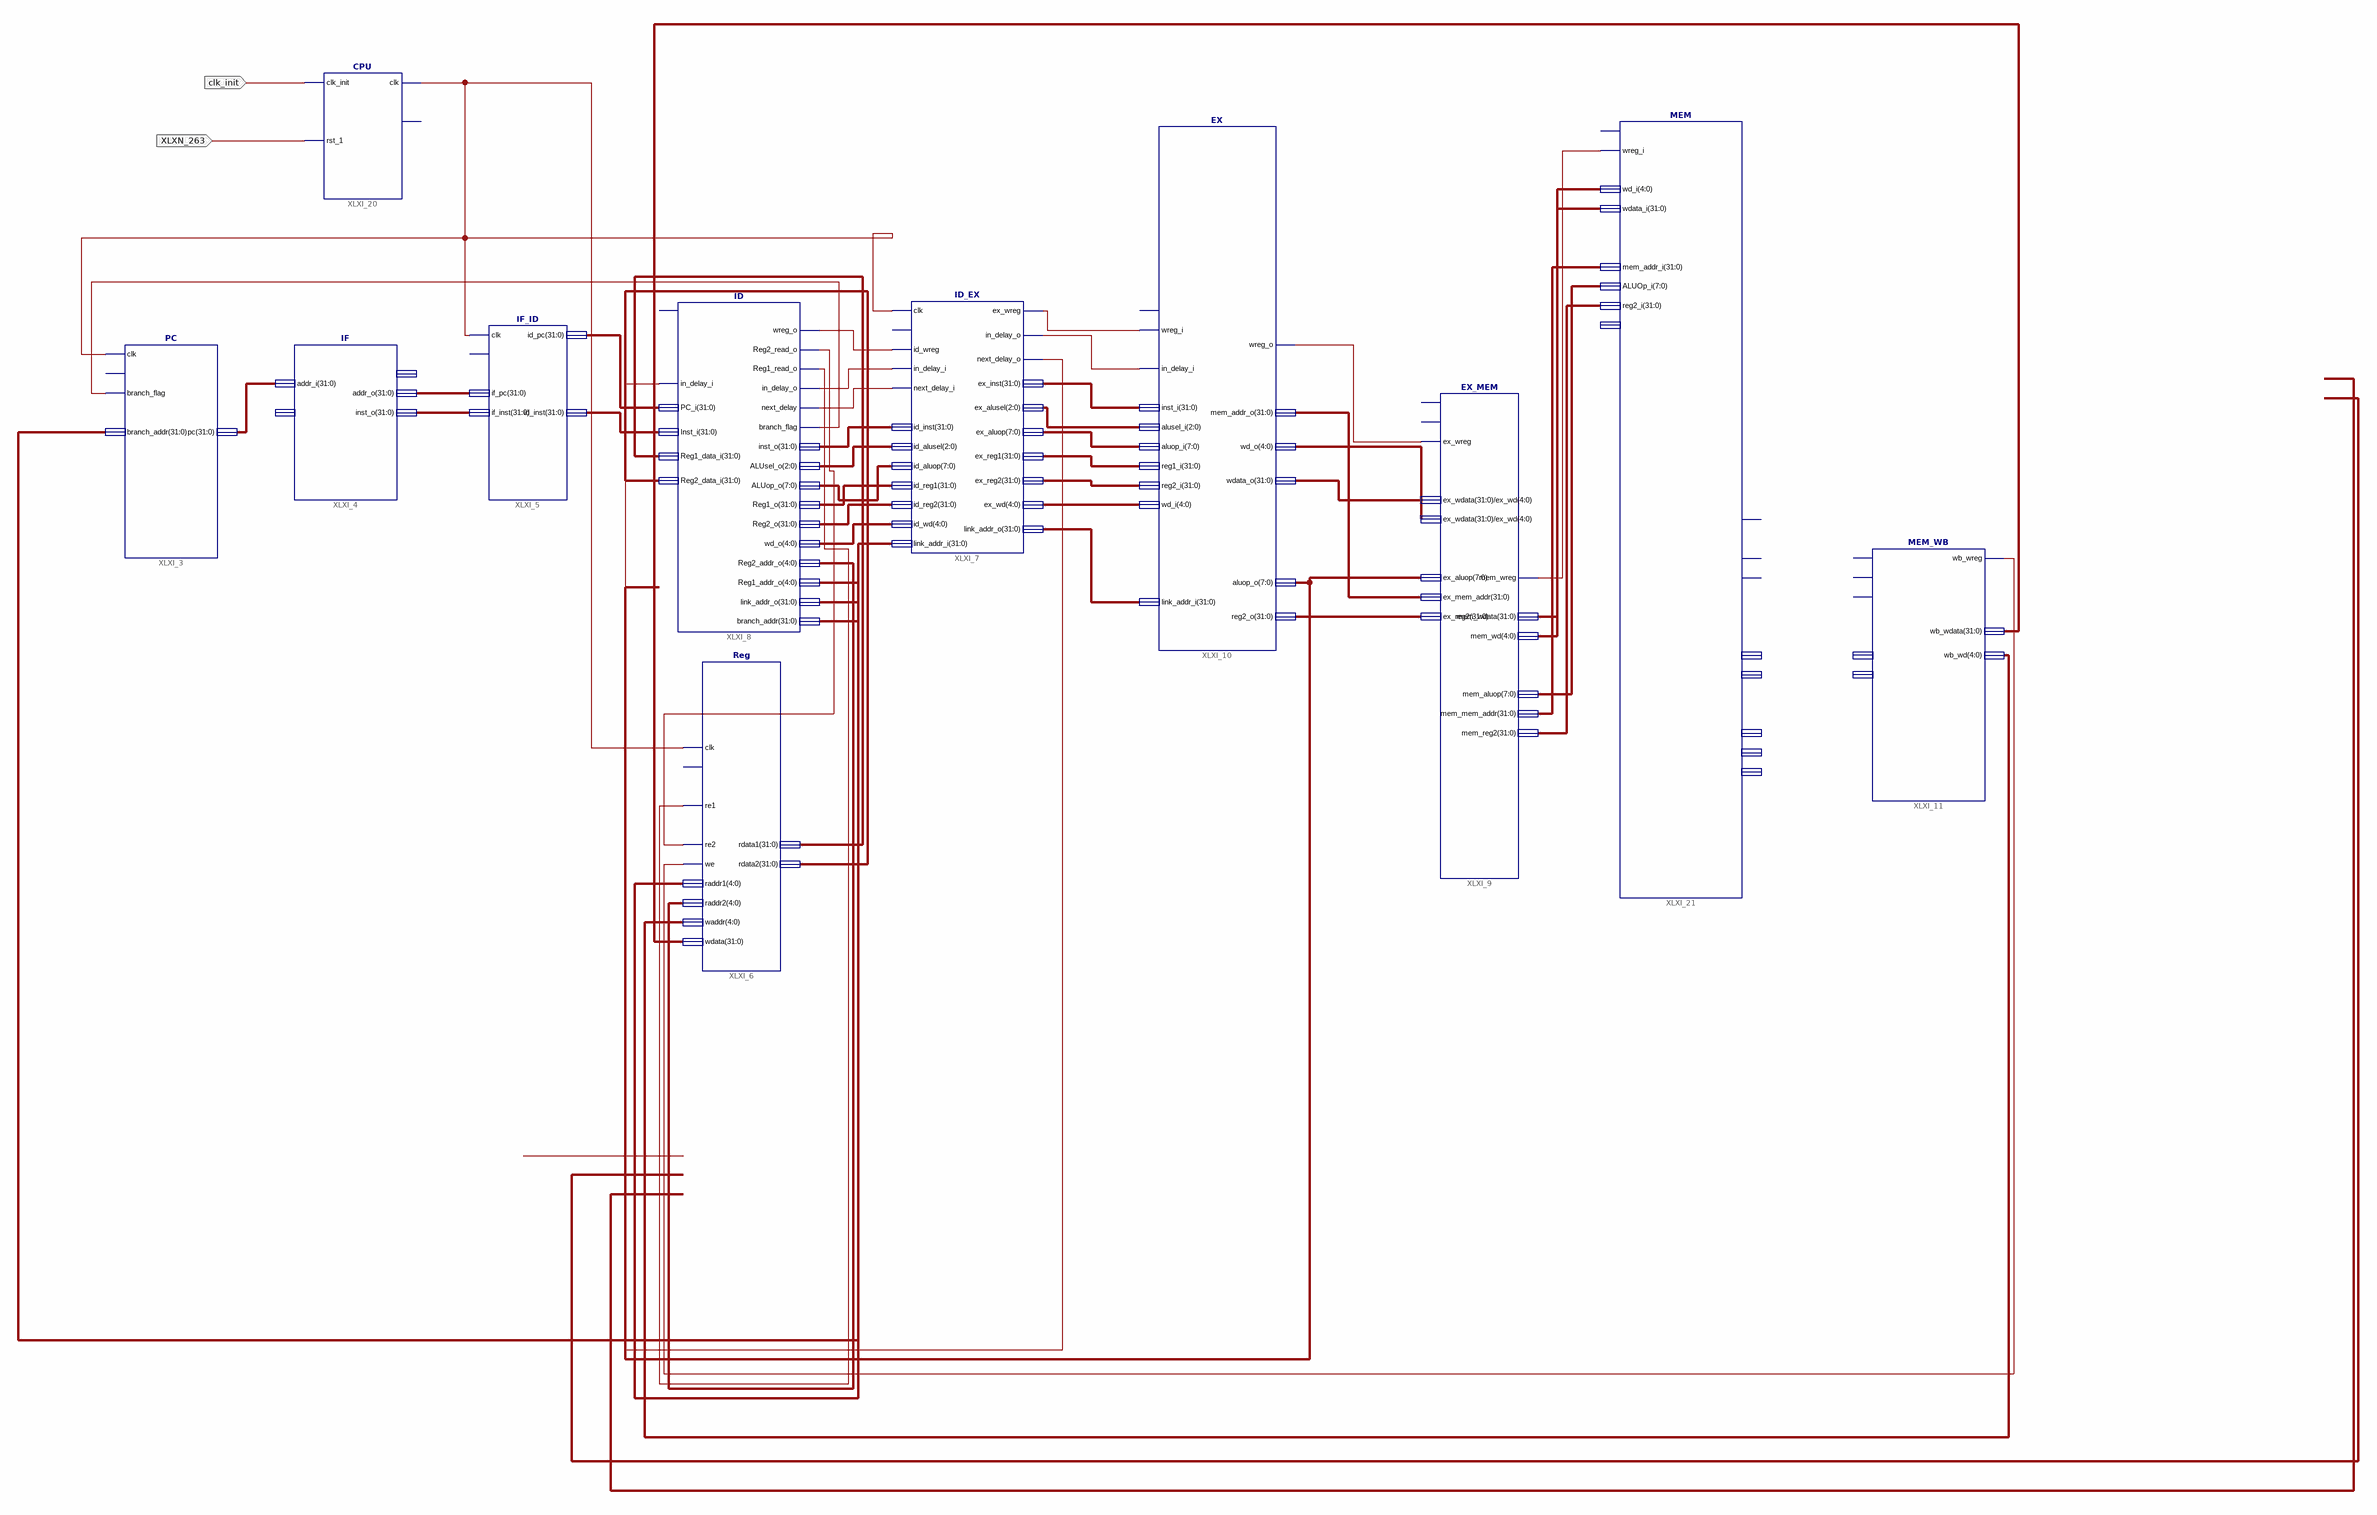
[diagram p0: schematic sheet 1]
// Xilinx ISE schematic ExcitedMIPS.sch (spartan6) as structural Verilog: 11 symbols, 2 ports
module ExcitedMIPS (
  input  clk_init,
  input  XLXN_263
);

  wire XLXN_14, XLXN_15, XLXN_23, XLXN_24, XLXN_33, XLXN_34, XLXN_50, XLXN_53, XLXN_170, XLXN_294, XLXN_349,
       XLXN_454, XLXN_478, XLXN_500;
  wire [2:0] XLXN_46, XLXN_289;
  wire [4:0] XLXN_12, XLXN_13, XLXN_171, XLXN_291, XLXN_295, XLXN_352;
  wire [7:0] XLXN_288, XLXN_290, XLXN_320, XLXN_355;
  wire [31:0] XLXN_4, XLXN_10, XLXN_11, XLXN_17, XLXN_21, XLXN_22, XLXN_30, XLXN_44, XLXN_47, XLXN_92,
       XLXN_95, XLXN_96, XLXN_296, XLXN_321, XLXN_322, XLXN_351, XLXN_356, XLXN_360, XLXN_456, XLXN_457,
       XLXN_466, XLXN_467, XLXN_468, XLXN_469, XLXN_479, XLXN_485;

  IF_ID XLXI_5 (.clk(XLXN_500), .if_pc(XLXN_4), .if_inst(XLXN_485), .id_pc(XLXN_468), .id_inst(XLXN_469));  // open: rst
  ID_EX XLXI_7 (
    .clk(XLXN_500), .id_wreg(XLXN_24), .in_delay_i(XLXN_23), .next_delay_i(XLXN_294), .id_inst(XLXN_21),
    .id_alusel(XLXN_289), .id_aluop(XLXN_290), .id_reg1(XLXN_296), .id_reg2(XLXN_17), .id_wd(XLXN_295),
    .link_addr_i(XLXN_22), .ex_wreg(XLXN_53), .in_delay_o(XLXN_478), .next_delay_o(XLXN_33),
    .ex_inst(XLXN_479), .ex_alusel(XLXN_46), .ex_aluop(XLXN_320), .ex_reg1(XLXN_321), .ex_reg2(XLXN_322),
    .ex_wd(XLXN_291), .link_addr_o(XLXN_44));  // open: rst
  ID XLXI_8 (
    .in_delay_i(XLXN_33), .PC_i(XLXN_468), .Inst_i(XLXN_469), .Reg1_data_i(XLXN_10), .Reg2_data_i(XLXN_11),
    .wreg_o(XLXN_24), .Reg2_read_o(XLXN_15), .Reg1_read_o(XLXN_14), .in_delay_o(XLXN_23),
    .next_delay(XLXN_294), .branch_flag(XLXN_34), .inst_o(XLXN_21), .ALUsel_o(XLXN_289), .ALUop_o(XLXN_290),
    .Reg1_o(XLXN_296), .Reg2_o(XLXN_17), .wd_o(XLXN_295), .Reg2_addr_o(XLXN_13), .Reg1_addr_o(XLXN_12),
    .link_addr_o(XLXN_22), .branch_addr(XLXN_30));  // open: rst
  EX_MEM XLXI_9 (
    .ex_wreg(XLXN_50), .ex_wdata(XLXN_96), .ex_wd(XLXN_96), .ex_aluop(XLXN_288), .ex_mem_addr(XLXN_92),
    .ex_reg2(XLXN_47), .mem_wreg(XLXN_349), .mem_wdata(XLXN_351), .mem_wd(XLXN_352), .mem_aluop(XLXN_355),
    .mem_mem_addr(XLXN_360), .mem_reg2(XLXN_356));  // open: clk, rst
  EX XLXI_10 (
    .wreg_i(XLXN_53), .in_delay_i(XLXN_478), .inst_i(XLXN_479), .alusel_i(XLXN_46), .aluop_i(XLXN_320),
    .reg1_i(XLXN_321), .reg2_i(XLXN_322), .wd_i(XLXN_291), .link_addr_i(XLXN_44), .wreg_o(XLXN_50),
    .mem_addr_o(XLXN_92), .wd_o(XLXN_96), .wdata_o(XLXN_95), .aluop_o(XLXN_288), .reg2_o(XLXN_47));  // open: rst
  MEM_WB XLXI_11 (
    .wb_wreg(XLXN_170), .wb_wdata(XLXN_467), .wb_wd(XLXN_171));  // open: clk, rst, mem_wreg, mem_wdata, mem_wd
  CPU XLXI_20 (.clk_init(clk_init), .rst_1(XLXN_263), .clk(XLXN_500));  // open: rst
  MEM XLXI_21 (
    .wreg_i(XLXN_349), .wd_i(XLXN_352), .wdata_i(XLXN_351), .mem_addr_i(XLXN_360), .ALUOp_i(XLXN_355),
    .reg2_i(XLXN_356));  // open: rst, mem_data_i, wreg_o, mem_we_o, mem_ce_o, wd_o, wdata_o, mem_addr_o, mem_sel_o, mem_data_o
  PC XLXI_3 (.clk(XLXN_500), .branch_flag(XLXN_34), .branch_addr(XLXN_30), .pc(XLXN_466));  // open: rst
  IF XLXI_4 (.addr_i(XLXN_466), .addr_o(XLXN_4), .inst_o(XLXN_485));  // open: inst_i, mem_addr_o
  Reg XLXI_6 (
    .clk(XLXN_500), .re1(XLXN_14), .re2(XLXN_15), .we(XLXN_170), .raddr1(XLXN_12), .raddr2(XLXN_13),
    .waddr(XLXN_171), .wdata(XLXN_467), .epc_i(XLXN_456), .exc_code_i(XLXN_457), .rdata1(XLXN_10),
    .rdata2(XLXN_11), .excodenable(XLXN_454));  // open: rst
endmodule
